# EAGLE design DMGC-CPU-01_2-2 (EAGLE 9.6.2)
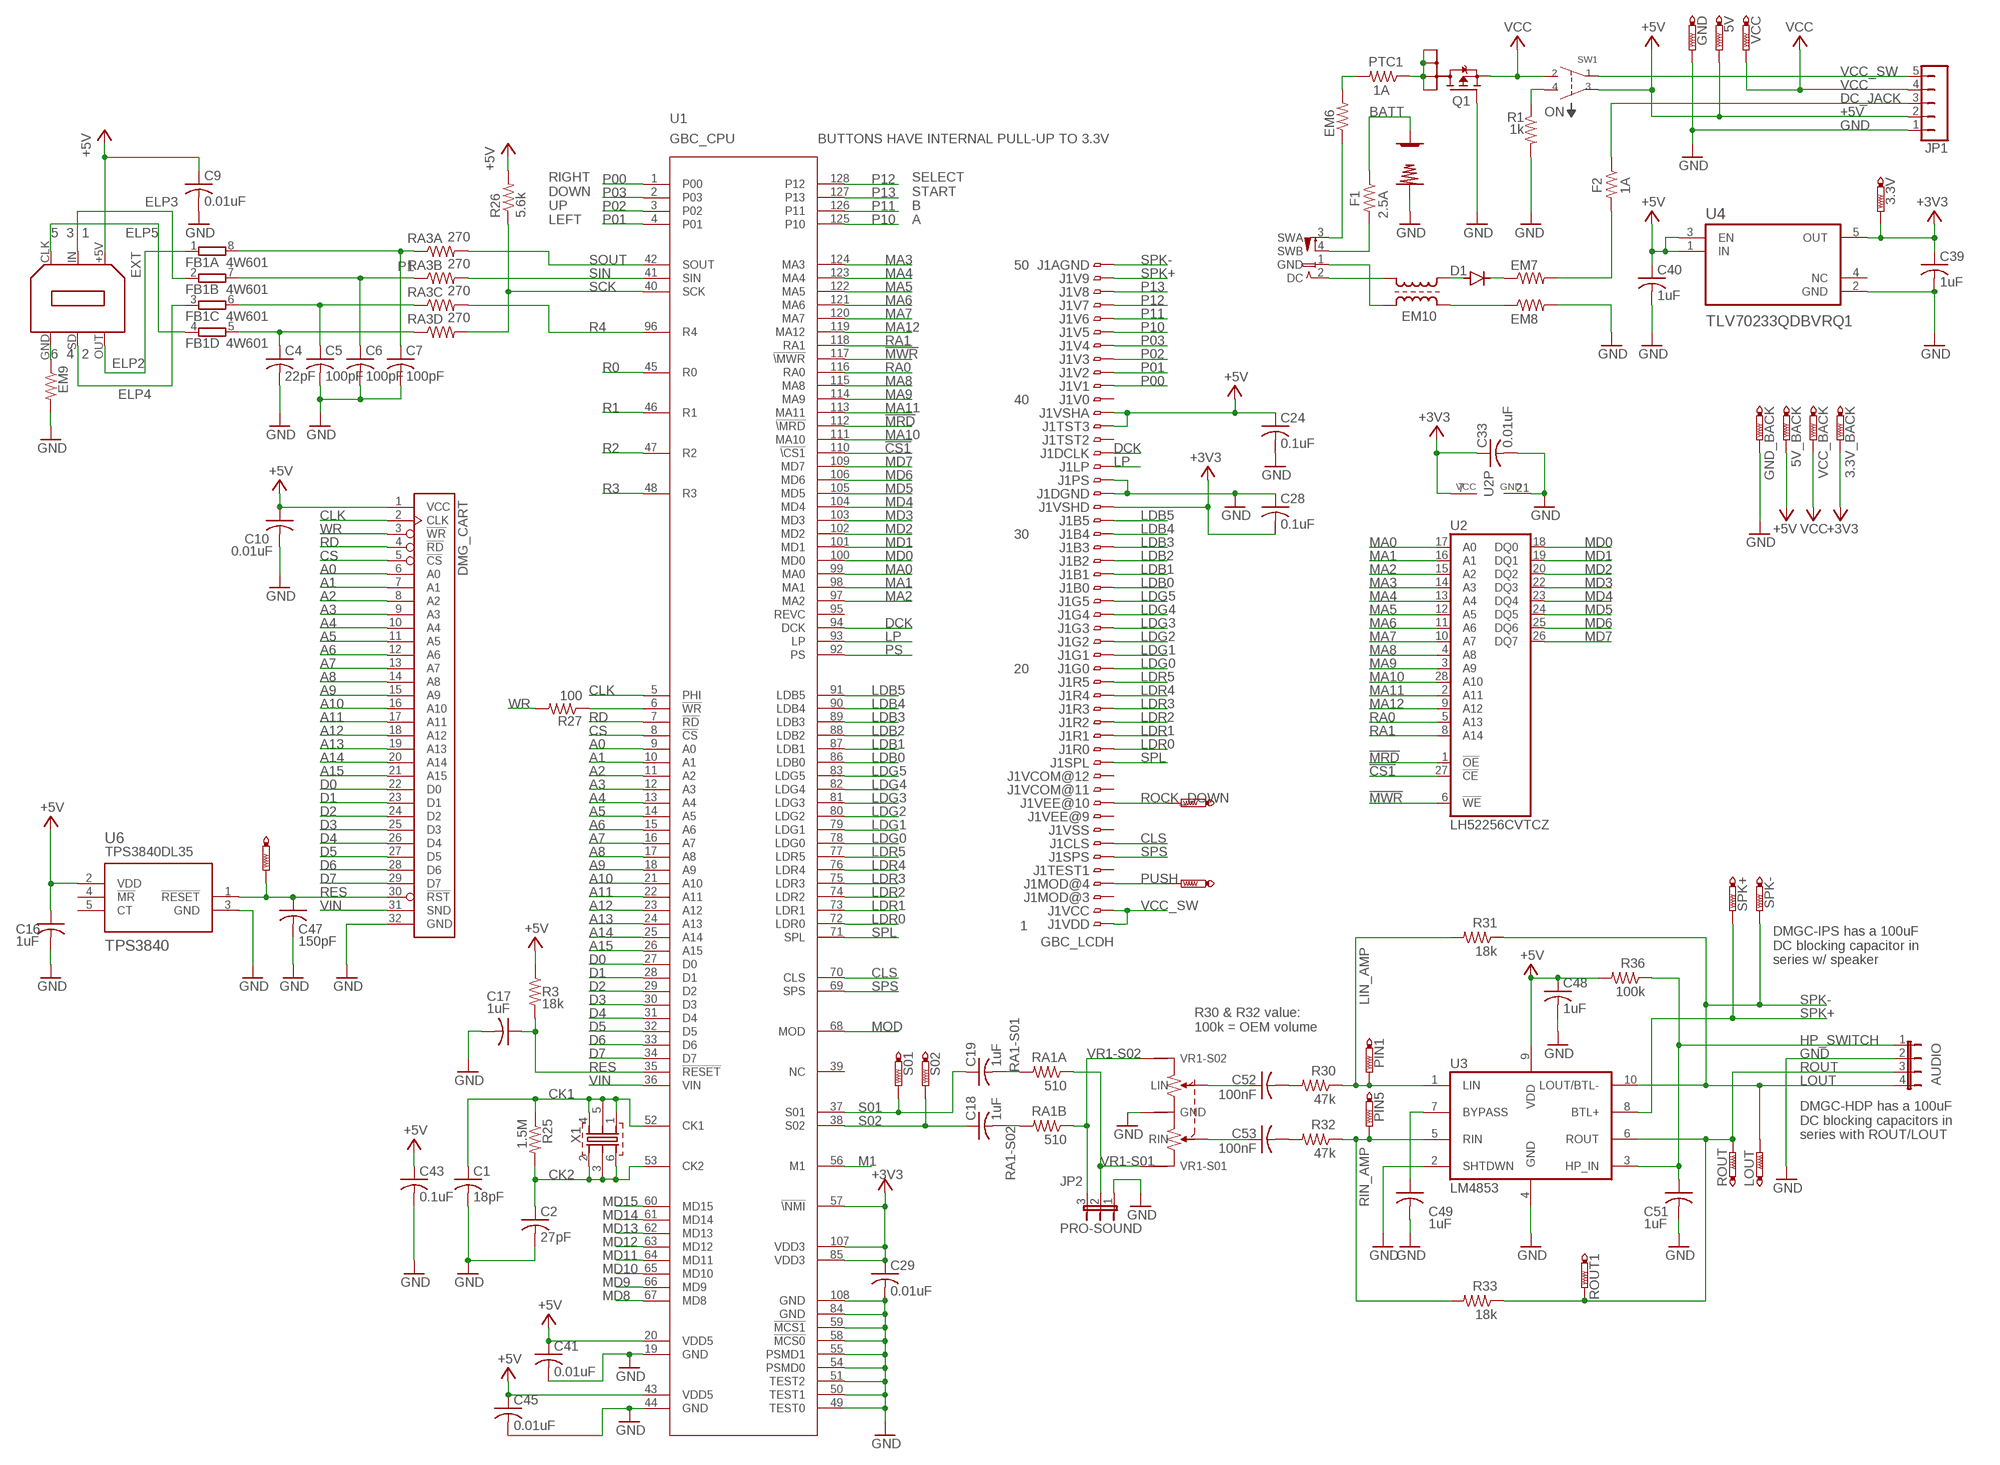
[diagram p0: schematic, sheet 1]

## Parts
3.3V  PTR1B1,27  [B1,27]
3.3V_BACK  PTR1B1,27  [B1,27]
5V  PTR1B1,27  [B1,27]
5V_BACK  PTR1B1,27  [B1,27]
+  DMG_BAT_POS  [DMG_BAT_POS]
-  DMG_BAT_NEG  [DMG_BAT_NEG]
AUDIO  JP4E  [JP4]
C1  18pF  C-USC0603  [C0603]
C2  27pF  C-USC0603  [C0603]
C4  22pF  C-USC0603  [C0603]
C5  100pF  C-USC0603  [C0603]
C6  100pF  C-USC0603  [C0603]
C7  100pF  C-USC0603  [C0603]
C9  0.01uF  C-USC0603  [C0603]
C10  0.01uF  C-USC0603  [C0603]
C16  1uF  C-USC0603  [C0603]
C17  1uF  C-USC0603  [C0603]
C18  1uF  C-USC0603  [C0603]
C19  1uF  C-USC0603  [C0603]
C24  0.1uF  C-USC0603  [C0603]
C28  0.1uF  C-USC0603  [C0603]
C29  0.01uF  C-USC0603  [C0603]
C33  0.01uF  C-USC0603  [C0603]
C39  1uF  C-USC0603  [C0603]
C40  1uF  C-USC0603  [C0603]
C41  0.01uF  C-USC0603  [C0603]
C43  0.1uF  C-USC0603  [C0603]
C45  0.01uF  C-USC0603  [C0603]
C47  150pF  C-USC0603  [C0603]
C48  1uF  C-USC0603  [C0603]
C49  1uF  C-USC0603  [C0603]
C51  1uF  C-USC0603  [C0603]
C52  100nF  C-USC0603  [C0603]
C53  100nF  C-USC0603  [C0603]
D1  CGRM4001-G  [SOD-123_MINI-SMA]
DCJACK  DMG_DCJACK  [DMG_DCJACK]
EM6  BLM21P221SG  R-US_R0805  [R0805]
EM7  BLM21P221SG  R-US_R0805  [R0805]
EM8  BLM21P221SG  R-US_R0805  [R0805]
EM9  BLM21P221SG  R-US_R0603  [R0603]
EM10  ACM4532-801-2PA  [ACM4532]
EXT  LINKPORTDMG-LINK-SHORT  DMG_EXTDMG-LINK  [DMG_EXT]
F1  2.5A  R-US_R1206  [R1206]
F2  1A  R-US_R1206  [R1206]
FB1  4W601  4R-NEXB38V  [EXB38V]
GND  PTR1B1,27  [B1,27]
GND_BACK  PTR1B1,27  [B1,27]
J1  GBC_LCDH  [FH12-50S-0.5SH]
JP1  JP5  [JP5]
JP2  JP2E  [JP2]
LOUT  PTR1B1,27  [B1,27]
P1  DMG_CART  [DMG_CART]
PIN1  PTR1B1,27  [B1,27]
PIN5  PTR1B1,27  [B1,27]
PTC1  1A  R-US_R1206  [R1206]
PUSH  PTR1B1,27  [B1,27]
Q1  SI1401EDH  [SOT363_INFINEON]
R1  1k  R-US_R0603  [R0603]
R3  18k  R-US_R0603  [R0603]
R25  1.5M  R-US_R0603  [R0603]
R26  5.6k  R-US_R0603  [R0603]
R27  100  R-US_R0603  [R0603]
R30  47k  R-US_R0603  [R0603]
R31  18k  R-US_R0603  [R0603]
R32  47k  R-US_R0603  [R0603]
R33  18k  R-US_R0603  [R0603]
R36  100k  R-US_R0603  [R0603]
RA1A  510  R-US_R0603  [R0603]
RA1B  510  R-US_R0603  [R0603]
RA3A  270  R-US_R0603  [R0603]
RA3B  270  R-US_R0603  [R0603]
RA3C  270  R-US_R0603  [R0603]
RA3D  270  R-US_R0603  [R0603]
ROCKDOWN  PTR1B1,27  [B1,27]
ROUT  PTR1B1,27  [B1,27]
ROUT1  PTR1B1,27  [B1,27]
RST  PTR1B1,27  [B1,27]
S01  PTR1B1,27  [B1,27]
S02  PTR1B1,27  [B1,27]
SPK+  PTR1B1,27  [B1,27]
SPK-  PTR1B1,27  [B1,27]
SW1  DMG_SW  [DMG_SW]
U1  GBC_CPU  [QFP-128]
U2  LH52256CVTCZ  [TSOP1-28]
U3  LM4853  [VSSOP10]
U4  TLV70233QDBVRQ1  [SOT95P280X145-5N]
U6  TPS3840  [SOT-23-5]
U$1  DMG_VOL  [DMG_VOL]
VCC  PTR1B1,27  [B1,27]
VCC_BACK  PTR1B1,27  [B1,27]
X1  8.388608MHZ12SMX-B-4-PAD  [7.5X5-4-PAD]

## Nets
!CS1: U1.110(!\CS1) U2.27(!CE)
!MRD: U1.112(!\MRD) U2.1(!OE)
!MWR: U1.117(!\MWR) U2.6(!WE)
+3V3: 3.3V.TP 3.3V_BACK.TP C28.2 C29.1 C33.1 C39.1 J1.32 U1.57(!\NMI) U1.85(VDD3) U1.107(VDD3) U2.7(VCC) U4.5(OUT)
+5V: 5V.TP 5V_BACK.TP C9.1 C10.1 C16.1 C24.1 C40.1 C41.1 C43.1 C45.1 C48.1 EXT.+5V J1.38 J1.39 JP1.2 P1.1(VCC) R3.1 R26.2 R36.2 SW1.P$3 U1.20(VDD5) U1.43(VDD5) U3.9(VDD) U4.1(IN) U4.3(EN) U6.2(VDD)
A0: P1.6(A0) U1.9(A0)
A1: P1.7(A1) U1.10(A1)
A2: P1.8(A2) U1.11(A2)
A3: P1.9(A3) U1.12(A3)
A4: P1.10(A4) U1.13(A4)
A5: P1.11(A5) U1.14(A5)
A6: P1.12(A6) U1.15(A6)
A7: P1.13(A7) U1.16(A7)
A8: P1.14(A8) U1.17(A8)
A9: P1.15(A9) U1.18(A9)
A10: P1.16(A10) U1.21(A10)
A11: P1.17(A11) U1.22(A11)
A12: P1.18(A12) U1.23(A12)
A13: P1.19(A13) U1.24(A13)
A14: P1.20(A14) U1.25(A14)
A15: P1.21(A15) U1.26(A15)
BATT: +.P$1 F1.1
BATT_DC: DCJACK.3(SWA) EM6.1
CK1: C1.1 R25.1 U1.52(CK1) X1.1 X1.4 X1.5
CK2: C2.1 R25.2 U1.53(CK2) X1.2 X1.3 X1.6
CLK: P1.2(CLK) U1.5(PHI)
CLS: J1.7 U1.70(CLS)
CS: P1.5(!CS) U1.8(!CS)
D0: P1.22(D0) U1.27(D0)
D1: P1.23(D1) U1.28(D1)
D2: P1.24(D2) U1.29(D2)
D3: P1.25(D3) U1.30(D3)
D4: P1.26(D4) U1.31(D4)
D5: P1.27(D5) U1.32(D5)
D6: P1.28(D6) U1.33(D6)
D7: P1.29(D7) U1.34(D7)
DC_JACK: F2.1 JP1.3
DCK: J1.36 U1.94(DCK)
ELP2: EXT.OUT FB1.1
ELP3: EXT.IN FB1.2
ELP4: EXT.SD FB1.3
ELP5: EXT.CLK FB1.4
EM10_EM8: EM8.1 EM10.3
EM10_GND: DCJACK.1(GND) EM10.2
EM10_POS: DCJACK.2(DC) EM10.1
GND: -.P$1 AUDIO.2 C1.2 C2.2 C4.2 C5.2 C6.2 C7.2 C9.2 C10.2 C16.2 C17.2 C24.2 C28.1 C29.2 C33.2 C39.2 C40.2 C41.2 C43.2 C45.2 C47.2 C48.2 C49.2 C51.2 EM8.2 EM9.2 GND.TP GND_BACK.TP J1.33 J1.34 JP1.1 JP2.1 P1.32(GND) Q1.3(G) R1.2 U1.19(GND) U1.44(GND) U1.49(TEST0) U1.50(TEST1) U1.51(TEST2) U1.54(PSMD0) U1.55(PSMD1) U1.58(!MCS0) U1.59(!MCS1) U1.84(GND) U1.108(GND) U2.21(GND) U3.2(SHTDWN) U3.4(GND) U4.2(GND) U6.3(GND) U$1.P$1(GND)
HP_SWITCH: AUDIO.1 C51.1 R36.1 U3.3(HP_IN)
LDB0: J1.26 U1.86(LDB0)
LDB1: J1.27 U1.87(LDB1)
LDB2: J1.28 U1.88(LDB2)
LDB3: J1.29 U1.89(LDB3)
LDB4: J1.30 U1.90(LDB4)
LDB5: J1.31 U1.91(LDB5)
LDG0: J1.20 U1.78(LDG0)
LDG1: J1.21 U1.79(LDG1)
LDG2: J1.22 U1.80(LDG2)
LDG3: J1.23 U1.81(LDG3)
LDG4: J1.24 U1.82(LDG4)
LDG5: J1.25 U1.83(LDG5)
LDR0: J1.14 U1.72(LDR0)
LDR1: J1.15 U1.73(LDR1)
LDR2: J1.16 U1.74(LDR2)
LDR3: J1.17 U1.75(LDR3)
LDR4: J1.18 U1.76(LDR4)
LDR5: J1.19 U1.77(LDR5)
LIN_AMP: PIN1.TP R30.1 R31.2 U3.1(LIN)
LP: J1.35 U1.93(LP)
M1: U1.56(M1)
MA0: U1.99(MA0) U2.17(A0)
MA1: U1.98(MA1) U2.16(A1)
MA2: U1.97(MA2) U2.15(A2)
MA3: U1.124(MA3) U2.14(A3)
MA4: U1.123(MA4) U2.13(A4)
MA5: U1.122(MA5) U2.12(A5)
MA6: U1.121(MA6) U2.11(A6)
MA7: U1.120(MA7) U2.10(A7)
MA8: U1.115(MA8) U2.4(A8)
MA9: U1.114(MA9) U2.3(A9)
MA10: U1.111(MA10) U2.28(A10)
MA11: U1.113(MA11) U2.2(A11)
MA12: U1.119(MA12) U2.9(A12)
MD0: U1.100(MD0) U2.18(DQ0)
MD1: U1.101(MD1) U2.19(DQ1)
MD2: U1.102(MD2) U2.20(DQ2)
MD3: U1.103(MD3) U2.22(DQ3)
MD4: U1.104(MD4) U2.23(DQ4)
MD5: U1.105(MD5) U2.24(DQ5)
MD6: U1.106(MD6) U2.25(DQ6)
MD7: U1.109(MD7) U2.26(DQ7)
MD8: U1.67(MD8)
MD9: U1.66(MD9)
MD10: U1.65(MD10)
MD11: U1.64(MD11)
MD12: U1.63(MD12)
MD13: U1.62(MD13)
MD14: U1.61(MD14)
MD15: U1.60(MD15)
MOD: U1.68(MOD)
N$1: C7.1 FB1.8 RA3A.1
N$2: C6.1 FB1.7 RA3B.1
N$4: C52.2 R30.2
N$5: C53.2 R32.2
N$6: C5.1 FB1.6 RA3C.1
N$7: C52.1 U$1.P$3(LIN)
N$8: R27.1 U1.6(!WR)
N$9: C4.1 FB1.5 RA3D.1
N$10: C53.1 U$1.P$2(RIN)
N$11: R1.1 SW1.P$4
N$13: D1.C EM7.1
N$15: EM7.2 F2.2
N$16: EM6.2 PTC1.2
N$24: EM9.1 EXT.GND
N$29: C49.1 U3.7(BYPASS)
P00: J1.41 U1.1(P00)
P01: J1.42 U1.4(P01)
P02: J1.43 U1.3(P02)
P03: J1.44 U1.2(P03)
P10: J1.45 U1.125(P10)
P11: J1.46 U1.126(P11)
P12: J1.47 U1.128(P12)
P13: J1.48 U1.127(P13)
PFET_DRAIN: PTC1.1 Q1.1(D1) Q1.2(D2) Q1.5(D5) Q1.6(D6)
PS: U1.92(PS)
PUSH: J1.4 PUSH.TP
R0: U1.45(R0)
R1: U1.46(R1)
R2: U1.47(R2)
R3: U1.48(R3)
R4: RA3C.2 U1.96(R4)
RA0: U1.116(RA0) U2.5(A13)
RA1: U1.118(RA1) U2.8(A14)
RA1-S01: C19.2 RA1A.2
RA1-S02: C18.2 RA1B.2
RD: P1.4(!RD) U1.7(!RD)
RES: C17.1 C47.1 P1.30(!RST) R3.2 RST.TP U1.35(!RESET) U6.1(!RESET)
RIN_AMP: PIN5.TP R32.1 R33.2 U3.5(RIN)
ROCK_DOWN: J1.10 ROCKDOWN.TP
ROUT: AUDIO.3 R33.1 ROUT1.TP ROUT.TP U3.6(ROUT)
RPP: D1.A EM10.4
S01: C19.1 S01.TP U1.37(S01)
S02: C18.1 S02.TP U1.38(S02)
SCK: R26.1 RA3D.2 U1.40(SCK)
SIN: RA3B.2 U1.41(SIN)
SOUT: RA3A.2 U1.42(SOUT)
SPK+: J1.49 SPK+.TP U3.8(BTL+)
SPK-: AUDIO.4 J1.50 LOUT.TP R31.1 SPK-.TP U3.10(LOUT/BTL-)
SPL: J1.13 U1.71(SPL)
SPS: J1.6 U1.69(SPS)
SW1B: DCJACK.4(SWB) F1.2
VCC: JP1.4 Q1.4(S) SW1.P$2 VCC.TP VCC_BACK.TP
VCC_SW: J1.1 J1.2 JP1.5 SW1.P$1
VIN: P1.31(SND) U1.36(VIN)
VR1-S01: JP2.2 RA1A.1 U$1.P$5(VR1-S01)
VR1-S02: JP2.3 RA1B.1 U$1.P$4(VR1-S02)
WR: P1.3(!WR) R27.2
Unconnected: J1.3 J1.5 J1.8 J1.9 J1.11 J1.12 J1.37 J1.40 U1.39(NC) U1.95(REVC) U4.4(NC) U6.4(!MR) U6.5(CT)

## Notes on the sheet
- BUTTONS HAVE INTERNAL PULL-UP TO 3.3V
- RIGHT
  DOWN
  UP
  LEFT
- SELECT
  START
  B
  A
- 5  3  1
- 50
- 6  4  2
- 40
- 30
- 20
- TPS3840DL35
- 1
- DMGC-IPS has a 100uF 
  DC blocking capacitor in
  series w/ speaker
- R30 & R32 value:
  100k = OEM volume
- LOUT
- DMGC-HDP has a 100uF 
  DC blocking capacitors in
  series with ROUT/LOUT
- PRO-SOUND

## Power pins joined to a net without a drawn wire
GND: EXT.SHIELD1(GND) EXT.SHIELD(GND) SW1.P$7(GND) SW1.P$8(GND) U$1.P$6(GND) U$1.P$7(GND)

## Library data of the parts
3.3V 3.3V_BACK 5V 5V_BACK GND GND_BACK LOUT PIN1 PIN5 PUSH ROCKDOWN ROUT ROUT1 RST S01 S02 SPK+ SPK- VCC VCC_BACK = testpad:PTR1: TEST PIN
+ = gameboy:DMG_BAT_POS
- = gameboy:DMG_BAT_NEG
AUDIO = jumper:JP4E: JUMPER
C1 C2 C4-C7 C9 C10 C16-C19 C24 C28 C29 C33 C39-C41 C43 C45 C47-C49 C51-C53 = rcl:C-US: CAPACITOR, American symbol; SPICEPREFIX: C
D1 = diode:CGRM400*-G: Molded plasitc,JEDEC SOD-123/Mini SMA Source: Comchip CGRM4001-G.pdf
DCJACK = gameboy:DMG_DCJACK
EM6-EM9 F1 F2 PTC1 R1 R3 R25-R27 R30-R33 R36 RA1A RA1B RA3A RA3B RA3C RA3D = rcl:R-US_: RESISTOR, American symbol; SPICEPREFIX: R
EM10 = gameboy:ACM4532-801-2P: TRANSFORMER SMD transformer; OC_FARNELL: unknown; OC_NEWARK: unknown
EXT = gameboy:DMG_EXT
FB1 = resistor-dil:4R-N: Array Chip Resistor Source: RS Component / Phycomp; OC_FARNELL: unknown; OC_NEWARK: unknown
J1 = gameboy:GBC_LCD: 0.5mm Pitch Connectors For FPC/FFC Source: Data sheet <http://www.hirose.co.jp/cataloge_hp/e58605370.pdf>; MPN: FH12-50S-0.5SH(55); OC_FARNELL: 1324557; OC_NEWARK: 34M6181
JP1 = jumper:JP5: JUMPER
JP2 = jumper:JP2E: JUMPER
P1 = gameboy:DMG_CART
Q1 = transistor-fet:SI1401EDH: OptiMOS(R)-P Small-Signal-Transistor Dual P-Channel, Enhancement mode, Super Logic Level (2.5 V rated) Source: http://www.infineon.com/upload/Document/BSD223P_Rev1.3.pdf
SW1 = gameboy:DMG_SW: DMG Power Switch
U1 = gameboy:GBC_CPU: lfxp3e_tqfp144 edit this description Auto generated by make-symbol-device-package-bsdl.ulp Rev. 20 Source: lfxp3e_tqfp144.bsm
U2 = gameboy:LH52256CVT: 256K (32K x 8) CMOS-Static RAM Source: http://download.cypress.com.edgesuite.net/design_resources/datasheets/contents/cy62256_8.pdf
U3 = gameboy:LM4853: LM4853
U4 = TLV70233QDBVRQ1:TLV70233QDBVRQ1: Check availability <https://pricing.snapeda.com/parts/TLV70233QDBVRQ1/Texas%20Instruments/view-part?ref=eda>; AVAILABILITY: In Stock; DESCRIPTION: Automotive 300-mA, high-PSRR, low-IQ, low-dropout voltage regulator with enable 5-SOT-23 -40 to 125; MF: Texas Instruments; MP: TLV70233QDBVRQ1; PACKAGE: SOT-23-5 Texas Instruments; PRICE: None; PURCHASE-URL: https://pricing.snapeda.com/search/part/TLV70233QDBVRQ1/?ref=eda
U6 = SOT95P280X145-5N:TPS3840
U$1 = gameboy:DMG_VOL
X1 = gameboy:8.388608MHZ: CRYSTALS WITH CAN GROUNDED

## Net classes
1 VCC: width 0.203 mm

## Board
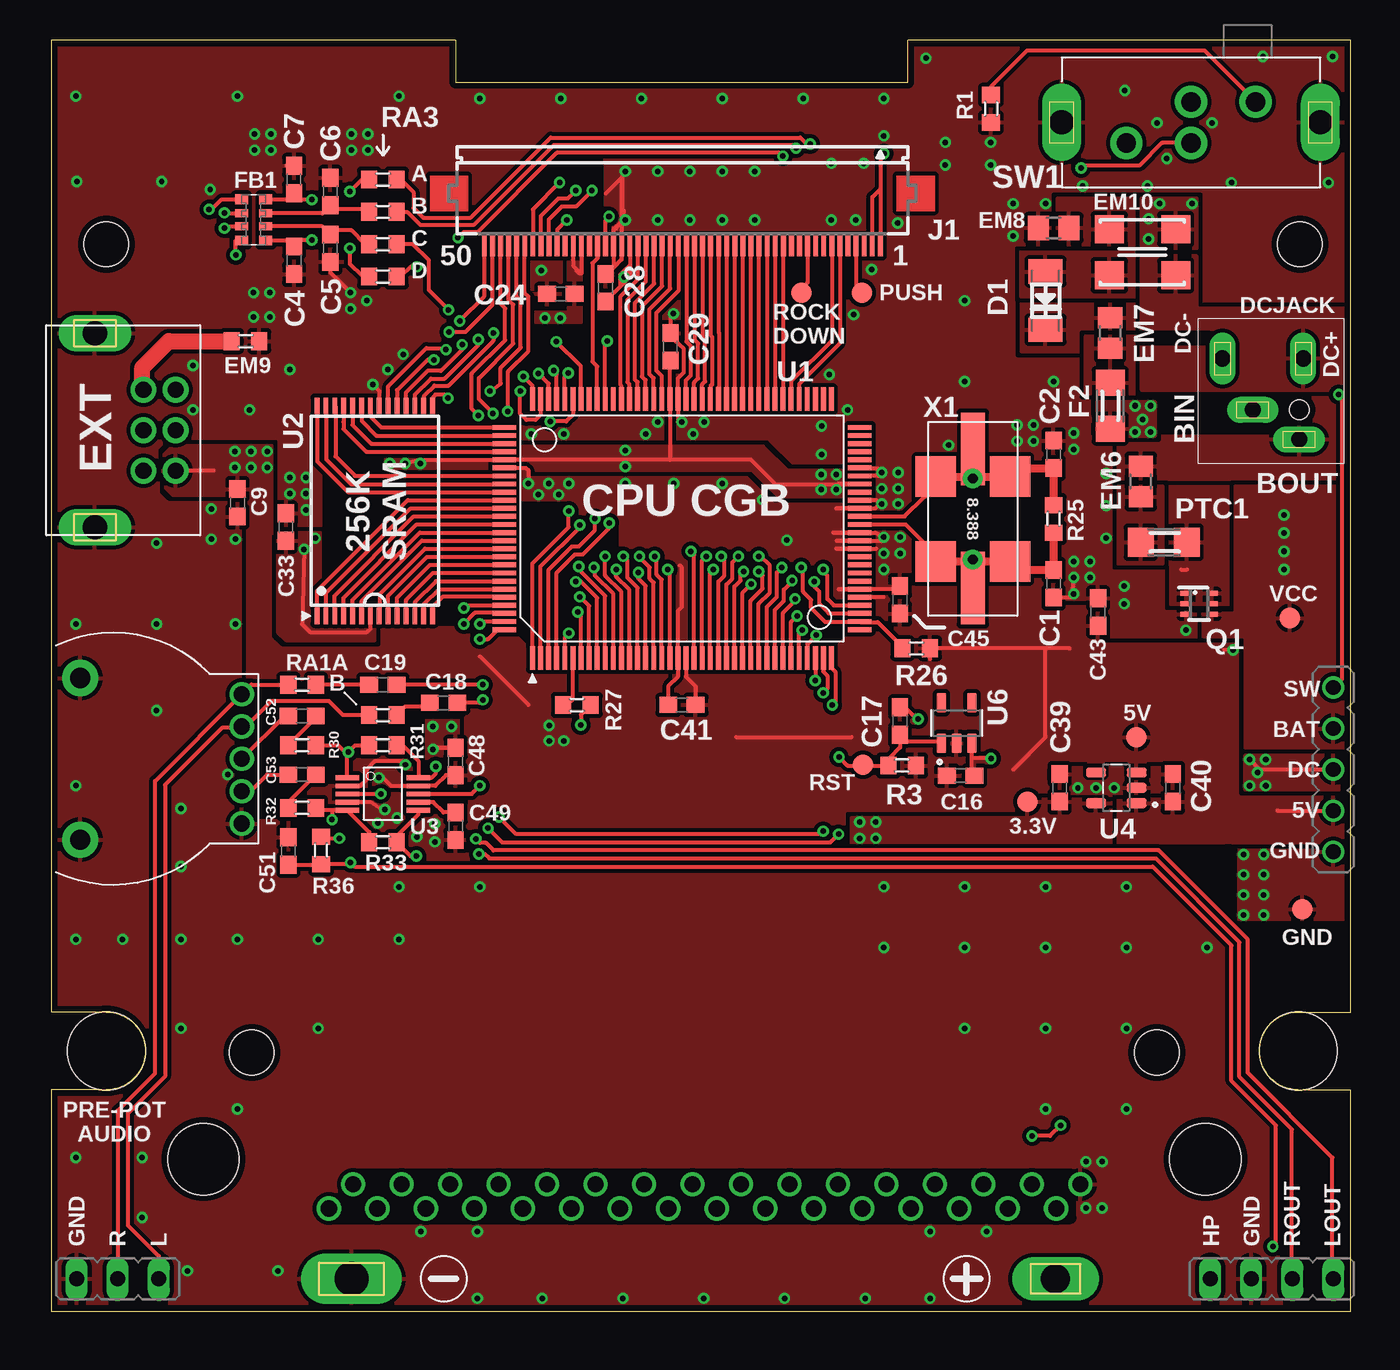
[diagram p1: board, top side]
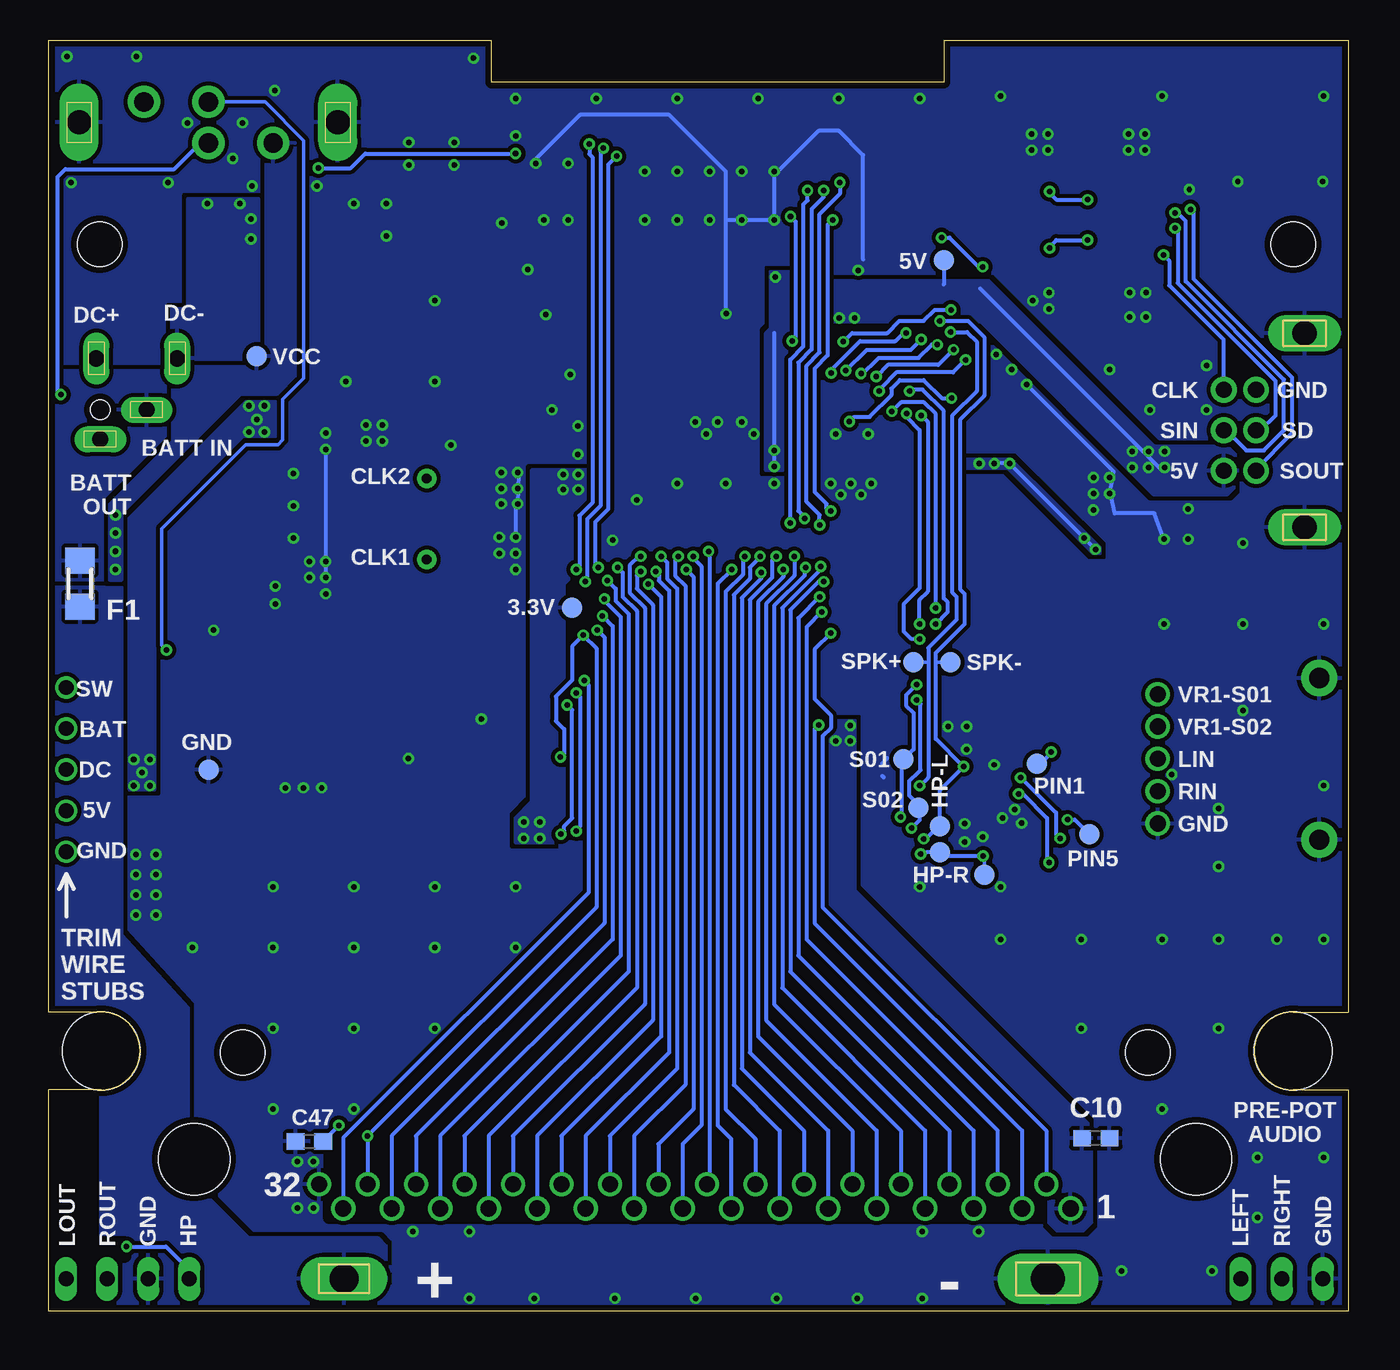
[diagram p2: board, bottom side, seen from below]

Size 80.4 x 78.6 mm. Coordinates in mm from the lower left corner, seen from the top.
Outline: 0,0 80.4,0 80.4,13.7 77.15,13.7 arc-180 77.15,18.5 80.4,18.5 80.4,78.6 53.01,78.6 53.01,76 25.01,76 25.01,78.6 0,78.6 0,18.5 3.4,18.5 arc-180 3.4,13.7 2.9,13.7 0,13.7 0,0
Copper layers (1*16): Top 0.0356mm / dielectric 1.5011mm / Bottom 0.0356mm
Design rules "jlcpcb *": minimum track width 8mil, minimum drill 13mil, track to track 7mil, track to pad 7mil, pad to pad 7mil, via to via 7mil, smd to smd 5mil, copper to edge 15mil, drill to drill 22mil, minimum pad ring 7mil, minimum via ring 7mil, stop-mask expansion 2.5mil, vias tented up to drill 14mil, thermal gap 10mil
Holes 2.75 mm at 3.4,66 77.25,66 12.4,16 68.4,16
Holes 4.4 mm at 9.4,9.4 71.4,9.4
Holes 4.8 mm at 3.4,16.1 77.14,16.1
tKeepout: area -2,5 to 83,27
tRestrict: area 17.2,47.5 to 17.5,52; area 21.5,35.5 to 21.7,36.5; area 28.5,49 to 32,49.7; area 34.5,47 to 34.7,48.7; area 17.1,5.8 to 63.1,8.4; area 22.5,34 to 25.3,37.5; area 12.9,30.8 to 13.8,32.4; area 33.8,66 to 35.3,66.4; area 34.3,64.6 to 35.1,64.8; area 32.1,66.8 to 33.8,71; area 49.9,47 to 50.1,52.1; area 72.6,23.5 to 81.4,28.5; 5 more areas
bRestrict: area 18.7,5.8 to 63.1,8.4; area 62.5,8.5 to 63,9.9; area 75.6,3.4 to 78.8,15.4

### Footprints (pad centres in the part's own frame; a part is rotated, then mirrored left to right if it is on the bottom)
B1,27 = smd 1.27 x 1.27: TP 0,0
DMG_BAT_POS = drill 1.8 long: P$1 0,0
DMG_BAT_NEG = drill 2.1 long: P$1 0,-0.008
JP4 = drill 0.914 long: 1 -3.81,0; 2 -1.27,0; 3 1.27,0; 4 3.81,0
C0603 = smd 1.1 x 1: 1 -0.85,0; 2 0.85,0
SOD-123_MINI-SMA = smd 1.5 x 2.1: A 1.8,0; C -1.8,0
DMG_DCJACK = drill 1 pad 1.6 long: 1 -2.5,0; 2 2.5,0; 3 2.25,-5; 4 -0.625,-3.175 | hole 1.2: 2.25,-3.175
R0805 = smd 1.3 x 1.5: 1 -0.95,0; 2 0.95,0
R0603 = smd 1 x 1.1: 1 -0.85,0; 2 0.85,0
ACM4532 = smd 1.8 x 1.75: 1 -2.05,1.425; 2 -2.05,-1.425; 3 2.05,-1.425; 4 2.05,1.425
DMG_EXT = drill 1 pad 1.6: +5V 2.5,5; CLK -2.5,5; GND -2.5,3; IN 0,5; OUT 2.5,3; SD 0,3 | drill 1.5 long: SHIELD -6,0; SHIELD1 6,0
R1206 = smd 1.6 x 1.803: 1 -1.422,0; 2 1.422,0
EXB38V = smd 0.6 x 0.8: 1 -1.275,-0.75; 4 1.275,-0.75; 5 1.275,0.75; 8 -1.275,0.75 | smd 0.5 x 0.8: 2 -0.4,-0.75; 3 0.4,-0.75; 6 0.4,0.75; 7 -0.4,0.75
FH12-50S-0.5SH = smd 0.3 x 1.3: 1 -12.25,3.25; 2 -11.75,3.25; 3 -11.25,3.25; 4 -10.75,3.25; 5 -10.25,3.25; 6 -9.75,3.25; 7 -9.25,3.25; 8 -8.75,3.25; 9 -8.25,3.25; 10 -7.75,3.25; 11 -7.25,3.25; 12 -6.75,3.25; 13 -6.25,3.25; 14 -5.75,3.25; 15 -5.25,3.25; 16 -4.75,3.25; 17 -4.25,3.25; 18 -3.75,3.25; 19 -3.25,3.25; 20 -2.75,3.25; 21 -2.25,3.25; 22 -1.75,3.25; 23 -1.25,3.25; 24 -0.75,3.25; 25 -0.25,3.25; 26 0.25,3.25; 27 0.75,3.25; 28 1.25,3.25; 29 1.75,3.25; 30 2.25,3.25; 31 2.75,3.25; 32 3.25,3.25; 33 3.75,3.25; 34 4.25,3.25; 35 4.75,3.25; 36 5.25,3.25; 37 5.75,3.25; 38 6.25,3.25; 39 6.75,3.25; 40 7.25,3.25; 41 7.75,3.25; 42 8.25,3.25; 43 8.75,3.25; 44 9.25,3.25; 45 9.75,3.25; 46 10.25,3.25; 47 10.75,3.25; 48 11.25,3.25; 49 11.75,3.25; 50 12.25,3.25
JP5 = drill 0.914: 1 -5.08,0; 2 -2.54,0; 3 0,0; 4 2.54,0; 5 5.08,0
JP2 = drill 0.914 long: 1 -2.54,0; 2 0,0; 3 2.54,0
DMG_CART = drill 1: 1 0,0; 2 -1.5,1.5; 3 0,3; 4 -1.5,4.5; 5 0,6; 6 -1.5,7.5; 7 0,9; 8 -1.5,10.5; 9 0,12; 10 -1.5,13.5; 11 0,15; 12 -1.5,16.5; 13 0,18; 14 -1.5,19.5; 15 0,21; 16 -1.5,22.5; 17 0,24; 18 -1.5,25.5; 19 0,27; 20 -1.5,28.5; 21 0,30; 22 -1.5,31.5; 23 0,33; 24 -1.5,34.5; 25 0,36; 26 -1.5,37.5; 27 0,39; 28 -1.5,40.5; 29 0,42; 30 -1.5,43.5; 31 0,45; 32 -1.5,46.5
SOT363_INFINEON = smd 0.3 x 0.7: 1 -0.65,-0.8; 2 0,-0.8; 3 0.65,-0.8; 4 0.65,0.8; 5 0,0.8; 6 -0.65,0.8
DMG_SW = drill 1.2 pad 2: P$1 0,-1.27; P$2 -4,-1.27; P$3 0,1.27; P$4 4,1.27 | drill 1.5 pad 2.4 long: P$7 -8,0; P$8 8,0
QFP-128 = smd 0.3 x 1.45: 1 -8.25,-4.5; 2 -7.75,-4.5; 3 -7.25,-4.5; 4 -6.75,-4.5; 5 -6.25,-4.5; 6 -5.75,-4.5; 7 -5.25,-4.5; 8 -4.75,-4.5; 9 -4.25,-4.5; 10 -3.75,-4.5; 11 -3.25,-4.5; 12 -2.75,-4.5; 13 -2.25,-4.5; 14 -1.75,-4.5; 15 -1.25,-4.5; 16 -0.75,-4.5; 17 -0.25,-4.5; 18 0.25,-4.5; 19 0.75,-4.5; 20 1.25,-4.5; 21 1.75,-4.5; 22 2.25,-4.5; 23 2.75,-4.5; 24 3.25,-4.5; 25 3.75,-4.5; 26 4.25,-4.5; 27 4.75,-4.5; 28 5.25,-4.5; 29 5.75,-4.5; 30 6.25,-4.5; 31 6.75,-4.5; 32 7.25,-4.5; 33 7.75,-4.5; 34 8.25,-4.5; 35 8.75,-4.5; 36 9.25,-4.5; 37 9.75,-4.5; 38 10.25,-4.5; 65 10.25,11.5; 66 9.75,11.5; 67 9.25,11.5; 68 8.75,11.5; 69 8.25,11.5; 70 7.75,11.5; 71 7.25,11.5; 72 6.75,11.5; 73 6.25,11.5; 74 5.75,11.5; 75 5.25,11.5; 76 4.75,11.5; 77 4.25,11.5; 78 3.75,11.5; 79 3.25,11.5; 80 2.75,11.5; 81 2.25,11.5; 82 1.75,11.5; 83 1.25,11.5; 84 0.75,11.5; 85 0.25,11.5; 86 -0.25,11.5; 87 -0.75,11.5; 88 -1.25,11.5; 89 -1.75,11.5; 90 -2.25,11.5; 91 -2.75,11.5; 92 -3.25,11.5; 93 -3.75,11.5; 94 -4.25,11.5; 95 -4.75,11.5; 96 -5.25,11.5; 97 -5.75,11.5; 98 -6.25,11.5; 99 -6.75,11.5; 100 -7.25,11.5; 101 -7.75,11.5; 102 -8.25,11.5 | smd 1.45 x 0.3: 39 12,-2.75; 40 12,-2.25; 41 12,-1.75; 42 12,-1.25; 43 12,-0.75; 44 12,-0.25; 45 12,0.25; 46 12,0.75; 47 12,1.25; 48 12,1.75; 49 12,2.25; 50 12,2.75; 51 12,3.25; 52 12,3.75; 53 12,4.25; 54 12,4.75; 55 12,5.25; 56 12,5.75; 57 12,6.25; 58 12,6.75; 59 12,7.25; 60 12,7.75; 61 12,8.25; 62 12,8.75; 63 12,9.25; 64 12,9.75; 103 -10,9.75; 104 -10,9.25; 105 -10,8.75; 106 -10,8.25; 107 -10,7.75; 108 -10,7.25; 109 -10,6.75; 110 -10,6.25; 111 -10,5.75; 112 -10,5.25; 113 -10,4.75; 114 -10,4.25; 115 -10,3.75; 116 -10,3.25; 117 -10,2.75; 118 -10,2.25; 119 -10,1.75; 120 -10,1.25; 121 -10,0.75; 122 -10,0.25; 123 -10,-0.25; 124 -10,-0.75; 125 -10,-1.25; 126 -10,-1.75; 127 -10,-2.25; 128 -10,-2.75
TSOP1-28 = smd 1 x 0.3: 1 -6.5,3.575; 2 -6.5,3.025; 3 -6.5,2.475; 4 -6.5,1.925; 5 -6.5,1.375; 6 -6.5,0.825; 7 -6.5,0.275; 8 -6.5,-0.275; 9 -6.5,-0.825; 10 -6.5,-1.375; 11 -6.5,-1.925; 12 -6.5,-2.475; 13 -6.5,-3.025; 14 -6.5,-3.575; 15 6.5,-3.575; 16 6.5,-3.025; 17 6.5,-2.475; 18 6.5,-1.925; 19 6.5,-1.375; 20 6.5,-0.825; 21 6.5,-0.275; 22 6.5,0.275; 23 6.5,0.825; 24 6.5,1.375; 25 6.5,1.925; 26 6.5,2.475; 27 6.5,3.025; 28 6.5,3.575
VSSOP10 = smd 1.45 x 0.3: 1 -2.2,0.985; 2 -2.2,0.485; 3 -2.2,-0.015; 4 -2.2,-0.515; 5 -2.2,-1.015; 6 2.2,-1.015; 7 2.2,-0.515; 8 2.2,-0.015; 9 2.2,0.485; 10 2.2,0.985
SOT95P280X145-5N = smd 1.21 x 0.59: 1 -1.255,0.95; 2 -1.255,0; 3 -1.255,-0.95; 4 1.255,-0.95; 5 1.255,0.95
SOT-23-5 = smd 1.21 x 0.59: 1 -1.255,0.95; 2 -1.255,0; 3 -1.255,-0.95; 4 1.255,-0.95; 5 1.255,0.95
DMG_VOL = drill 1 pad 1.5: P$1 -4,-5; P$2 -2,-5; P$3 0,-5; P$4 2,-5; P$5 4,-5 | drill 1.25 pad 2.25: P$6 -5,5; P$7 5,5
7.5X5-4-PAD = smd 2.5 x 2.5: 1 2.3,-2.625; 2 2.3,2.625; 3 -2.3,2.625; 4 -2.3,-2.625 | smd 1.5 x 4.5: 5 0,-4.275; 6 0,4.325 | drill 0.6 pad 1.2: P$1 0,2.5; P$2 0,-2.5

### Placement (x,y rotation side)
3.3V  60.38,31.5 0 top
3.3V_BACK  48.01,43.5 0 bottom
5V  67.14,35.5 0 top
5V_BACK  25.01,65 0 bottom
+  62.13,2 0 top
-  18.57,2 0 top
AUDIO  75.51,2 0 top
C1  62.01,45 270 top
C2  62.01,53 90 top
C4  15.01,65 270 top
C5  17.26,65.75 270 top
C6  17.26,69.25 90 top
C7  15.01,70 90 top
C9  11.51,50 270 top
C10  15.61,10.7 0 bottom
C16  56.26,33.12 0 top
C17  52.51,36.5 90 top
C18  24.26,37.62 180 top
C19  20.51,38.75 180 top
C24  31.51,62.92 180 top
C28  34.28,63.3 270 top
C29  38.3,59.65 90 top
C33  14.51,48.5 90 top
C39  62.38,32.38 90 top
C40  69.39,32.38 90 top
C41  39.01,37.5 180 top
C43  64.76,43.25 90 top
C45  52.51,44 90 top
C47  64.26,10.5 180 bottom
C48  25.01,34 90 top
C49  25.01,30 270 top
C51  14.67,28.47 90 top
C52  15.51,36.81 0 top
C53  15.51,33.19 0 top
D1  61.51,62.5 90 top
DCJACK  74.96,58.93 0 top
EM6  67.4,51.31 270 top
EM7  65.51,60.5 270 top
EM8  62.01,67 180 top
EM9  12.01,60 0 top
EM10  67.51,65.5 180 top
EXT  2.69,54.48 270 top
F1  78.46,45 90 bottom
F2  65.51,56 90 top
FB1  12.51,67.5 270 top
GND  77.39,24.88 0 top
GND_BACK  70.51,33.5 0 bottom
J1  39.04,69.14 180 top
JP1  79.31,33.5 90 top
JP2  4.1,2 0 top
LOUT  25.26,30 0 bottom
P1  17.17,6.35 270 top
PIN1  19.26,33.88 0 bottom
PIN5  16.01,29.5 0 bottom
PTC1  68.82,47.56 180 top
PUSH  50.15,63 0 top
Q1  71.01,43.75 270 top
R1  58.13,74.38 270 top
R3  52.63,33.75 180 top
R25  62.01,49 90 top
R26  53.51,41 0 top
R27  32.51,37.5 0 top
R30  15.51,35 180 top
R31  20.51,35 180 top
R32  15.51,31.12 180 top
R33  20.51,29 180 top
R36  16.68,28.5 90 top
RA1A  15.51,38.75 0 top
RA1B  20.51,36.88 0 top
RA3A  20.51,70 0 top
RA3B  20.51,68 0 top
RA3C  20.51,66 0 top
RA3D  20.51,64 0 top
ROCKDOWN  46.4,63 0 top
ROUT  25.26,28.38 0 bottom
ROUT1  22.51,27 0 bottom
RST  50.2,33.8 0 top
S01  27.51,34.12 0 bottom
S02  26.57,31.12 0 bottom
SPK+  26.88,40.12 0 bottom
SPK-  24.6,40.12 0 bottom
SW1  70.51,73.53 0 top
U1  38.02,44.91 0 top
U2  20.01,49.5 90 top
U3  20.51,32 0 top
U4  65.89,32.38 180 top
U6  56.01,36.38 90 top
U$1  6.78,34.16 90 top
VCC  76.64,42.88 0 top
VCC_BACK  67.54,59.06 0 bottom
X1  57.01,49 0 top

### Tracks (layer width: path | path; a pad name or v marks a point on that pad's centre or on a via)
!CS1
  Top 0.25: U2.27 17.01,55.48 17.01,52.69 18.54,51.16 U1.110
!MRD
  Top 0.25: U2.1 16.45,42.91 16.45,44.56 22.04,50.16 U1.112
!MWR
  Top 0.25: U2.6 19.2,42.91 19.2,43.94 22.92,47.66 U1.117
+3V3  (via drill 0.34)
  Top 0.203: C28.2 34.28,62.81
  Top 0.25: J1.32 35.79,64.7 | 35.79,64.7 35.79,64.3 | 35.79,64.3 35.79,63.99 35.76,63.96 | 35.76,63.96 35.45,63.65 | 35.45,63.65 35.2,63.4 | 35.2,63.4 34.28,62.49 C28.2 34.26,62.48 | v15.63,47.12 15.51,42.5 16.01,42 19.51,42 19.73,42.23 U2.7 | 38.26,52.66 43.29,52.66 44.82,51.12 49.98,51.12 U1.57 49.99,51.19 48.7,51.19 | 38.26,52.66 35.51,52.66 | 35.51,52.66 U1.107 22.73,52.66 v21.88,52.44 | v35.51,52.25 35.51,52.66 | C29.1 38.27,58.77 U1.85 38.26,52.66 | v35.43,63.96 35.76,63.96 | v35.43,63.96 35.45,63.95 35.45,63.65 | v35.43,63.96 35.43,64.35 | 35.43,64.35 35.79,64.7 | v35.43,63.96 35.43,64.06 35.67,64.3 35.79,64.3 | 35.2,63.4 35.2,64.11 35.43,64.35
  Bottom 0.25: v15.63,47.12 v20.95,52.44 v21.88,52.44 | 35.51,60.5 v35.51,52.25
  other vias: 48.57,51.75 48.57,50.81 47.63,50.81 47.63,51.75 35.51,53.25 22.82,52.44 16.32,47.81 50.01,29.25 50.01,30.25 51.01,29.25 51.01,30.25
  pour Top (isolate 0.25): 22.01,53.5 44.01,53.5 45.51,52 49.51,52 49.51,50.38 45.01,50.38 43.38,52 28.01,52 27.51,51.5 22.01,51.5 20.7,52 20.7,53
  pour Bottom (isolate 0.25): 35.01,52 36.01,52 36.01,60.5 35.71,60.8 35.71,64.3 33.01,64.3 33.01,61 34.01,60 34.01,53
  pour Bottom (isolate 0.25): 20.88,52.69 15.38,47.25 15.38,46.88 15.76,46.88 21.01,52.12 24.01,52.12 24.01,52.69
  pour Top (isolate 0.25): 14.01,48.12 14.01,42 14.51,41.5 20.01,41.5 20.01,43.5 19.51,43.5 19.51,42.5 16.63,42.5 16.63,48.12
  pour Top (isolate 0.25): 49.51,30.5 49.51,27.5 65.89,27.5 65.54,27.84 65.54,31.62 60.13,31.62 60.13,30.5
  pour Bottom (isolate 0.25): 50.51,31.5 51.51,30.5 51.51,29 48.51,29 48.51,45 46.51,47 46.51,52 50.51,52
+5V  (via drill 0.34, 0.35)
  Top 0.203: 72.54,40.9 v73.11,40.9
  Top 0.25: U1.20 39.26,39.25 39.86,38.65 C41.1 39.86,37.85 | 51.5,44.16 U1.43 | v20.26,33 20.51,33 21.02,32.48 U3.9 23.74,32.48 24.41,33.15 C48.1 | 42.36,35.5 49.51,35.5 | 54.36,40.35 R26.2 | 54.36,41.3 R26.2 | 63.01,41 61.51,41 | 61.51,41 R26.2 | 75.85,30.96 JP1.2 | R36.2 16.79,29.25 v17.81,29.25 | 59.51,33.5 61.51,35.5 61.51,41 | 26.51,40.5 29.51,37.5 | EXT.+5V 7.83,52 10.01,52 | 32.29,65.22 J1.39 32.29,64.67 32.79,64.17 J1.38 | 32.68,64.17 32.51,64.35
  Bottom 0.203: v73.11,40.9 73.41,41.2 73.41,48.4 68.21,53.6 66.21,53.6 65.91,53.9 65.91,56.4 64.61,57.7 64.61,72.4 67.01,74.8 SW1.P$3
  Bottom 0.25: v17.81,29.25 18.07,29.51 18.07,30.84 20.23,33 v20.26,33 | 11.51,52 22.75,63.24 | 5V_BACK.TP 25.01,63.5
  other vias: 30.54,61.44 31.48,61.44 13.35,53.19 12.35,53.19 12.35,52.19 13.35,52.19 11.35,52.19 11.35,53.19 30.79,35.28 30.79,36.22 31.7,35.28
  pour Top (isolate 0.25, rank 2): 32.01,68.38 32.01,61.75 29.51,61.75 29.51,61.19 32.78,61.19 32.78,68.38
  pour Bottom (isolate 0.25, rank 2): 32.51,63.75 22.26,63.75 12.01,53.5 7.51,53.5 6.51,52.5 6.51,51.5 7.51,50.5 12.01,50.5 22.7,61.19 32.45,61.19 32.51,61.25
  pour Bottom (isolate 0.25, rank 2): 32.51,36.5 32.51,25 18.51,11 18.51,5.5 18.01,5 16.38,5 15.88,5.5 15.88,11.38 30.51,26 30.51,36.5
  pour Top (isolate 0.25): 18.51,34 18.51,32.5 22.51,32.5 22.51,33.5 21.51,34.5 19.01,34.5
  pour Top (isolate 0.25, rank 5): 7.51,53.5 6.91,52.9 6.91,51.1 7.51,50.5 12.13,50.5 12.13,39.12 25.63,39.12 25.63,34 24.76,34 24.76,29.5 49.26,29.5 49.26,30.75 61.01,30.75 61.01,31.88 62.01,31.88 62.01,33.88 66.51,33.88 66.51,32.12 66.01,31.62 66.01,29 82.14,29 82.14,34.38 73.39,34.38 73.39,41.22 64.79,41.22 64.79,43.53 61.51,43.52 61.51,46.5 54.13,46.5 54.13,44.75 50.63,44.75 50.63,43.12 47.26,39.75 30.76,39.75 28.26,42.25 20.26,42.25 20.26,41.25 14.51,41.25 13.63,42.12 13.63,53.5
A0  (via drill 0.34)
  Top 0.25: U1.9 33.77,44.12 32.76,45.12 v32.45,45.12
  Bottom 0.25: v32.45,45.12 32.76,45.12 34.51,43.38 34.51,21 24.67,11.16 P1.6
A1  (via drill 0.34)
  Top 0.25: U1.10 34.27,44.24 32.63,45.88 v32.63,46.06
  Bottom 0.25: v32.63,46.06 32.63,45.88 35.01,43.5 35.01,20 26.17,11.16 P1.7
A2  (via drill 0.34)
  Top 0.25: U1.11 34.77,44.37 33.63,45.5 33.63,46 v33.57,46
  Bottom 0.25: v33.57,46 33.63,45.94 33.63,45.5 35.51,43.62 35.51,19 27.67,11.16 P1.8
A3  (via drill 0.34)
  Top 0.25: U1.12 35.27,44.49 34.26,45.5 v34.26,46.69
  Bottom 0.25: v34.26,46.69 34.26,45.5 36.01,43.75 36.01,18 29.17,11.16 P1.9
A4  (via drill 0.34)
  Top 0.25: U1.13 35.77,44.62 34.95,45.44 v34.95,45.88
  Bottom 0.25: v34.95,45.88 34.95,45.44 36.51,43.88 36.51,17 30.67,11.16 P1.10
A5  (via drill 0.34)
  Top 0.25: U1.14 36.27,44.74 35.63,45.38 35.63,46.44 v35.38,46.69
  Bottom 0.25: v35.38,46.69 35.63,46.44 35.63,45.38 37.01,44 37.01,16 32.17,11.16 P1.11
A6  (via drill 0.34)
  Top 0.25: v36.32,45.69 36.32,45.31 36.77,44.87 U1.15
  Bottom 0.25: v36.32,45.69 36.32,45.31 37.51,44.12 37.51,15 33.67,11.16 P1.12
A7  (via drill 0.34)
  Top 0.25: U1.16 37.27,45.06 37.01,45.31 37.01,46 36.38,46.62 v36.38,46.69
  Bottom 0.25: v36.38,46.69 36.38,46.62 37.01,46 37.01,45.31 38.01,44.31 38.01,14 35.17,11.16 P1.13
A8  (via drill 0.34)
  Top 0.25: U1.17 37.76,45.25 37.45,45.56 37.45,46.62 v37.32,46.69
  Bottom 0.25: v37.32,46.69 37.45,46.56 37.45,45.56 38.51,44.5 38.51,12.5 36.67,10.66 P1.14
A9  (via drill 0.34)
  Top 0.25: U1.18 38.26,46 v38.13,45.88
  Bottom 0.25: v38.13,45.88 39.01,45 39.01,11.5 38.17,10.66 P1.15
A10  (via drill 0.34)
  Top 0.25: U1.21 39.76,46.81 v39.57,47
  Bottom 0.25: v39.57,47 39.51,46.62 39.51,8.5 39.67,8.34 P1.16
A11  (via drill 0.34)
  Top 0.25: U1.22 40.26,46.44 v40.51,46.69
  Bottom 0.25: v40.51,46.69 40.51,46.56 40.01,46.06 40.01,11.5 41.17,10.34 P1.17
A12  (via drill 0.34)
  Top 0.25: U1.23 40.76,45.69 v40.95,45.88
  Bottom 0.25: v40.95,45.88 40.51,45.44 40.51,12.5 42.67,10.34 P1.18
A13  (via drill 0.34)
  Top 0.25: U1.24 41.26,45.12 41.63,45.5 41.63,46.5 v41.45,46.69
  Bottom 0.25: v41.45,46.69 41.63,46.5 41.63,45.5 41.01,44.88 41.01,14 44.17,10.84 P1.19
A14  (via drill 0.34)
  Top 0.25: U1.25 41.76,44.94 42.13,45.31 42.13,46.31 v42.51,46.69
  Bottom 0.25: v42.51,46.69 42.13,46.31 42.13,45.31 41.51,44.69 41.51,15 45.67,10.84 P1.20
A15  (via drill 0.34)
  Top 0.25: U1.26 42.26,44.81 42.63,45.19 42.63,45.56 v42.82,45.75
  Bottom 0.25: v42.82,45.75 42.63,45.56 42.63,45.19 42.01,44.56 42.01,16 47.17,10.84 P1.21
BATT
  pour Bottom (isolate 0.25, rank 2): 59.51,-1 59.51,4 60.01,4.5 68.01,4.5 71.76,8.25 71.76,18.73 75.89,23.25 75.89,44.75 83.01,44.75 83.01,0 81.51,-1.5 60.01,-1.05
BATT_DC
  pour Top (isolate 0.25, rank 3): 75.76,56.5 75.76,54.08 66.01,54.08 66.01,51.5 82.04,51.5 82.04,56.5
CK1
  Top 0.25: U1.52 52.85,48.66 54.51,47 X1.4 | X1.5 57.01,46.27 56.9,46.38
  Top 0.5: X1.4 56.9,46.38 X1.1 59.53,45.85 C1.1 R25.1
CK2
  Top 0.203: X1.6 57.01,51.73 56.9,51.62
  Top 0.25: U1.53 52.79,49.16 54.01,50.38 54.51,50.62 X1.3
  Top 0.5: X1.3 56.9,51.62 X1.2 59.53,52.15 C2.1 R25.2
CLK  (via drill 0.34)
  Top 0.25: U1.5 31.76,41.68 v32.01,41.94
  Bottom 0.25: v32.01,41.94 33.01,40.94 33.01,37.88 32.01,36.88 32.01,36.06 32.51,35.56 32.51,25 18.67,11.16 P1.2
CLS
  Top 0.25: J1.7 48.29,60.03 45.77,57.51 U1.70
CS  (via drill 0.34)
  Top 0.25: U1.8 33.27,43.62 v32.7,44.19
  Bottom 0.25: v32.7,44.19 34.01,42.88 34.01,22 23.17,11.16 P1.5
D0  (via drill 0.34)
  Top 0.25: U1.27 42.76,44.44 v43.29,44.97
  Bottom 0.25: v43.29,44.97 42.51,44.19 42.51,17 48.67,10.84 P1.22
D1  (via drill 0.34)
  Top 0.25: U1.28 43.26,43.94 44.01,44.69 44.01,45.5 v43.76,45.75
  Bottom 0.25: v43.76,45.75 44.01,45.5 44.01,44.69 43.01,43.69 43.01,18 50.17,10.84 P1.23
D2  (via drill 0.34)
  Top 0.25: U1.29 43.76,43.75 44.45,44.44 44.45,46.12 43.88,46.69 v43.76,46.69
  Bottom 0.25: v43.76,46.69 43.88,46.69 44.45,46.12 44.45,44.44 43.51,43.5 43.51,19 51.67,10.84 P1.24
D3  (via drill 0.34)
  Top 0.25: U1.30 44.26,43.56 44.88,44.19 44.88,45.69 v45.2,46
  Bottom 0.25: v45.2,46 44.88,45.69 44.88,44.19 44.01,43.31 44.01,20 53.17,10.84 P1.25
D4  (via drill 0.34)
  Top 0.25: U1.31 44.76,43.38 45.32,43.94 45.32,44.62 45.82,45.12 v45.82,45.19
  Bottom 0.25: v45.82,45.19 45.32,44.69 45.32,43.94 44.51,43.12 44.51,21 54.67,10.84 P1.26
D5  (via drill 0.34)
  Top 0.25: U1.32 45.27,43.19 45.95,43.88 45.95,44 v46.01,44.06
  Bottom 0.25: v46.01,44.06 46.01,43.94 45.01,42.94 45.01,22 56.17,10.84 P1.27
D6  (via drill 0.34)
  Top 0.25: U1.33 45.77,42.63 v46.13,43
  Bottom 0.25: v46.13,43 45.51,42.38 45.51,23 57.67,10.84 P1.28
D7  (via drill 0.34)
  Top 0.25: U1.34 46.27,41.94 v46.45,42.12
  Bottom 0.25: v46.45,42.12 46.01,41.69 46.01,24 59.17,10.84 P1.29
DC_JACK  (via drill 0.35)
  Top 0.25: JP1.3 74.76,33.5 v74.14,34.12
  other vias: 68.01,56 75.14,34.12 75.14,32.5 74.14,32.5 74.64,33.31 67.04,56 68.01,54.38 67.04,54.38 67.51,55.16
  pour Top (rank 2): 79.64,34.38 79.64,32.25 73.89,32.25 73.89,34.38
  pour Bottom (isolate 0.25, rank 2): 73.89,32.25 75.39,32.25 75.39,49.12 68.26,56.25 66.39,56.25 66.39,54.12 68.39,54.12 73.89,48.62
  pour Top (isolate 0.25, rank 2): 64.73,56.25 68.26,56.25 68.26,54.12 64.73,54.12
DCK
  Top 0.25: 33.77,65.87 J1.36 33.79,65.14 33.48,64.83 33.48,58.73 33.77,58.45 U1.94
ELP2  (via drill 0.34)
  Top 0.25: v9.76,68.15 9.91,68.15 10.54,68.78 FB1.1
  Bottom 0.25: v9.76,68.15 9.56,67.95 9.56,63.85 3.47,57.76 3.47,54.29 5.69,52.07 EXT.OUT
ELP3  (via drill 0.34)
  Top 0.25: v10.7,67.94 10.74,67.9 FB1.2
  Bottom 0.25: EXT.IN 7.54,54.48 6.31,53.25 5.2,53.25 3.97,54.48 3.97,57.62 10.05,63.69 10.05,67.41 10.58,67.94 v10.7,67.94
ELP4  (via drill 0.34)
  Top 0.25: v10.7,66.99 10.75,66.99 10.86,67.1 FB1.3
  Bottom 0.25: v10.7,66.99 10.55,66.84 10.55,63.59 4.5,57.54 4.5,55.4 5.42,54.48 EXT.SD
ELP5  (via drill 0.34)
  Top 0.25: v11.41,65.34 11.41,66.22 FB1.4
  Bottom 0.25: EXT.CLK 7.69,60.08 11.06,63.45 11.06,64.99 v11.41,65.34
EM10_EM8
  pour Top (isolate 0.25, rank 5): 62.25,68.81 62.25,65.5 67.01,65.5 67.01,68.81
EM10_GND  (via drill 0.34)
  other vias: 70.57,68.5 68.57,68.5 67.89,67.56 67.89,66.31
  pour Bottom (isolate 0.25, rank 2): 67.45,68.81 67.45,58.62 67.89,58.19 67.89,58.12 72.76,58.12 72.76,62 71.76,62 71.76,68.81
  pour Top (isolate 0.25, rank 2): 67.45,68.81 67.45,65.75 70.86,65.75 70.86,68.81
EM10_POS
  pour Top (isolate 0.25): 67.45,65.25 67.45,57 81.51,57 81.51,62 70.86,62 70.86,65.25
GND  (via drill 0.33, 0.34)
  Top 0.25: C41.2 38.16,38.65 38.76,39.25 U1.19 38.76,43.31 39.01,43.56 39.01,46 38.88,46.12 | C45.2 52.32,44.66 U1.44 | v38.48,61.7 38.31,61.52 38.31,60.51 C29.2 38.3,60.26 39.13,59.52 39.13,58.07 38.76,57.69 U1.84 38.77,55.01 v39.01,55 | v20.63,31.03 20.38,31.03 19.74,31.48 U3.4 | U2.21 20.29,56.91 v19.88,57.31 | v35.51,67.5 35.29,67.28 J1.33 35.29,65.05 34.79,64.55 | U1.108 29.35,52.16 29.51,52 v29.51,51.19 | C5.2 17.26,64.25 v18.51,63 | C7.2 14.54,70.85 | C1.2 63.16,44.15 v63.26,45.38 | U1.49 51.04,47.16 | U1.50 51.48,47.66 v51.51,47.88 50.98,48.16 U1.51 | U1.54 50.98,49.66 51.26,49.94 | 51.26,49.94 51.04,50.16 U1.55 | 51.26,49.94 v51.38,49.94 | U1.59 50.05,52.12 51.13,52.12 v51.38,51.88 51.17,51.66 U1.58 | 34.79,66.03 34.78,66.03 | 34.78,66.03 34.78,66.97 34.96,66.97 | 34.29,69.12 35.29,70.12 | v21.9,33.8 21.7,34 20.01,34 19.51,33.5 19.51,32.88 19.11,32.48 U3.2 | v53.63,36.62 53.55,36.62 52.82,37.35 C17.2 | C16.2 56.96,33.27 56.96,34.19 | 56.96,34.19 U6.3 | v58.13,34.19 56.96,34.19 | J1.34 34.76,65.92 34.76,66 | J1.34 34.79,64.55 | C28.1 34.38,64.15 34.79,64.55 | J1.34 34.78,66.03 | v23.73,29.03 23.85,29.15 23.86,29.15 23.74,29.03 v23.73,29.03
  Top 0.27: 35.29,67.39 35.29,70.12 | 35.39,68.11 35.39,67.49 35.29,67.39 | J1.34 34.79,66.89 35.29,67.39 | U1.51 48.38,48.16 | U1.50 48.6,47.66 | U1.49 48.57,47.16 | U1.44 48.73,44.66 | U1.54 48.57,49.66 | C48.2 23.7,34.84
  Bottom 0.25: v19.88,57.31 14.51,51.94 v14.76,50.56 14.7,50.5 14.46,49.35 11.99,49.35 v11.38,47.75 | v38.48,61.7 38.51,61.73 38.51,67.5 | 38.51,67.5 38.51,70.5 42.01,74 47.51,74 50.26,71.25 v50.26,71 | 38.51,67.5 v35.51,67.5 35.51,70.25 32.76,73 31.51,73 30.01,71.5 30.01,65.06 | v63.26,53.31 v63.26,45.38 | v51.38,51.88 51.32,51.81 v51.38,49.94 51.51,49.75 v51.51,47.88 | 28.82,33.89 28.51,34.2 | 28.82,33.11 28.72,33.01
  other vias: 23.61,34.75 13.57,71.81 30.31,64.38 21.38,30.5 20.2,30.19 22.6,29.34 23.6,36.16 35.51,70.5 37.51,70.5 48.26,71 48.26,67.5 49.76,67.5 59.51,68.5 59.51,66.5 13.57,72.81 12.57,72.81 12.57,71.81 18.57,71.81 18.57,72.81 19.57,72.81 19.57,71.81 18.51,62 19.51,62.5 13.51,63 12.51,63 13.51,61.5 12.51,61.5 20.82,58.25 21.76,59.19 14.76,51.56 15.76,51.56 15.76,50.56 15.76,49.56 9.88,47.75 9.88,49.62 63.26,46.38 64.26,46.38 64.26,45.38 63.26,54.31 60.76,54.81 60.76,53.81 59.76,53.81 59.76,54.81 51.38,50.88 52.38,51.88 52.38,50.88 52.38,49.94 51.51,46.88 51.51,45.88 52.51,46.88 52.51,47.88 30.13,50.5 31.38,50.5 30.76,51.19 32.01,51.19 40.38,55 39.7,54.25 29.7,54.25 31.7,54.25 64.01,9.25 65.01,9.25 65.01,6.38 64.01,6.38 9.82,69.38 49.63,61.64 48.13,57.94 50.76,64.44 62.01,57.5 65.26,51.81 65.26,49.81 65.26,47.81 66.39,43.75 55.51,53.56 35.51,51.19 38.51,51.19 41.51,51.19 44.01,50.19 45.51,47.69 1.51,9.5 1.51,23 1.51,32.5 1.51,42.5 74.96,77.6 14.01,2.5 26.36,0.8 30.36,0.8 35.36,0.8 40.36,0.8 45.36,0.8 50.36,0.8 54.36,0.8 8.01,23 11.51,23 16.51,23 21.51,23 16.51,17.5 8.01,17.5 5.61,9.5 11.51,12.5 5.61,5.8 8.01,27.5 6.51,42.5 6.51,37.15 6.51,47.5 51.51,72.7 56.51,62.5 56.51,57.5 56.51,22.5 61.51,22.5 66.51,22.5 61.51,17.5 66.51,17.5 66.51,12.5 61.51,12.5 51.51,22.5 56.51,17.5 21.51,26.25 26.51,26.25 51.51,26.25 56.51,26.25 61.51,26.25 66.51,26.25 11.38,42.5 79.26,77.6 79.01,69.8 31.51,75 36.51,75 41.51,75 46.51,75 51.51,75 26.51,75 21.51,75.15 11.51,75.15 1.51,75.15 12.26,55.75 14.76,58.25 49.26,55.75 71.51,22.5 73.01,69.8 61.51,68.5 63.26,44.38 37.51,55 36.76,54.25 24.75,36.16 65.76,32.38 64.64,32.38 63.51,32.38 73.76,28.25 75.01,28.25 75.01,27 73.76,27 75.01,25.75 73.76,25.75 75.01,24.5 73.76,24.5 66.39,44.84 1.57,69.88 22.86,4.92 57.86,4.92 54.36,4.92 26.36,4.92 23.73,30.16 58.11,72.3 58.11,70.9 55.31,70.9 55.31,72.3 63.81,69.6 67.81,69.6 69.01,71.3 71.81,73.5 54.11,77.5 52.36,67.3 68.41,73.5 70.2,42.12 37.51,67.5 39.51,67.5 41.51,67.5 43.51,67.5 39.51,70.5 41.51,70.5 43.51,70.5 66.41,75.5 8.01,31.1 10.91,33.2 4.41,23 8.41,2.5 47.65,53 47.65,54.75 8.76,58.5 8.76,55.75 6.82,69.88
  pour Top (isolate 0.25, rank 6): -3.49,80.5 -3.49,-1 -1.99,-2.5 84.01,-2.5 85.51,-1 85.51,78.5 83.51,80.5 0.51,80.5 -0.99,82 -1.99,82
  pour Bottom (isolate 0.25, rank 5): -4.99,85 86.51,85 90.51,81 90.51,-4.5 86.01,-9 -6.99,-9 -14.49,-1.5 -14.49,75.5
  pour Top (rank 2): 62.01,32.03 62.01,33.62 66.26,33.62 66.26,32.88 68.14,32.88 68.14,33.62 69.76,33.62 69.76,32.25 68.26,32.25 68.04,32.03
HP_SWITCH  (via drill 0.34)
  Top 0.25: U3.3 18.32,32 v20.38,32 | v75.57,4 75.76,4.19 75.76,11.5 73.01,14.25 73.01,22.62 68.14,27.5 18.76,27.5 v18.51,27.75 18.41,27.65 R36.1 16.65,27.62 C51.1
  Bottom 0.25: v20.38,32 20.13,32 18.63,30.5 18.63,27.88 v18.51,27.75 | v75.57,4 73.14,4 71.7,2.56 AUDIO.1
LDB0
  Top 0.25: U1.86 37.77,57.83 37.43,58.17 37.43,61.74 38.79,63.1 J1.26
LDB1
  Top 0.25: U1.87 37.27,57.71 36.99,57.98 36.99,61.95 38.29,63.25 J1.27
LDB2
  Top 0.25: U1.88 36.77,57.58 36.54,57.81 36.54,62.16 37.79,63.4 J1.28
LDB3
  Top 0.25: U1.89 36.27,57.46 36.09,57.63 36.09,62.35 37.29,63.55 J1.29
LDB4
  Top 0.25: U1.90 35.77,57.33 35.64,57.46 35.64,62.55 36.79,63.7 J1.30
LDB5
  Top 0.25: U1.91 35.27,57.23 35.19,57.31 35.19,62.73 36.29,63.83 J1.31
LDG0
  Top 0.25: U1.78 41.79,56.43 J1.20
LDG1
  Top 0.25: J1.21 41.29,60.56 41.3,60.55 41.3,57.17 41.27,57.13 U1.79
LDG2
  Top 0.25: U1.80 40.79,56.43 40.76,56.46 40.76,56.62 40.79,56.65 40.79,57.24 40.88,57.33 40.88,60.27 40.79,60.36 J1.22
LDG3
  Top 0.25: U1.81 40.29,56.43 40.26,56.46 40.26,57.32 40.45,57.51 40.45,60.04 40.29,60.2 J1.23
LDG4
  Top 0.25: U1.82 39.79,56.43 39.76,56.46 39.76,57.44 40.01,57.69 40.01,59.86 39.79,60.09 J1.24
LDG5
  Top 0.25: U1.83 39.26,57.57 39.57,57.88 39.57,59.69 39.29,59.97 J1.25
LDR0
  Top 0.25: U1.72 44.79,56.43 J1.14
LDR1
  Top 0.25: J1.15 44.27,65.87 U1.73
LDR2
  Top 0.25: U1.74 43.79,56.43 J1.16
LDR3
  Top 0.25: J1.17 43.27,65.87 U1.75
LDR4
  Top 0.25: U1.76 42.79,56.43 J1.18
LDR5
  Top 0.25: U1.77 42.29,56.43 J1.19
LIN_AMP  (via drill 0.34)
  Top 0.25: R31.2 18.79,35 18.31,34.52 U3.1 18.31,34.42 18.14,34.59 | R30.1 17.73,35 18.14,34.59 | v18.38,34.59 18.14,34.59
  Bottom 0.25: v18.38,34.59 18.38,34.51 19.01,33.88 PIN1.TP
LP  (via drill 0.35)
  Top 0.25: U1.93 34.27,59.87 v34.4,60 | J1.35 34.29,67.49 v34.5,67.7
  Bottom 0.25: v34.4,60 34.18,60.22 34.18,67.39 v34.5,67.7
MA0  (via drill 0.34)
  Top 0.25: U1.99 31.26,57.97 v31.07,58.19 | U2.17 22.48,56.69 23.48,57.69 24.32,57.69 26.42,59.78 v26.42,60.09
  Bottom 0.25: v31.07,58.19 29.79,59.44 27.07,59.44 v26.42,60.09
MA1  (via drill 0.34)
  Top 0.25: U1.98 31.76,57.81 v31.98,58.03 | U2.16 23.04,56.59 23.7,57.25 24.57,57.25 27.35,60.03 v27.35,60.5
  Bottom 0.25: v31.98,58.03 31.98,58.22 30.2,60 28.01,60 27.51,60.5 v27.35,60.5
MA2  (via drill 0.34)
  Top 0.25: U1.97 32.26,55.44 31.85,55.03 v30.85,55.03 | v24.54,56.47 24.32,56.69 23.76,56.69 23.58,56.51 U2.15
  Bottom 0.25: v30.85,55.03 30.57,55.31 29.6,55.31 28.26,56.66 28.26,57.06 27.73,57.59 26.26,57.59 25.13,56.47 v24.54,56.47
MA3
  Top 0.25: U1.124 27.99,44.19 24.2,44.19 23.58,43.58 U2.14
MA4
  Top 0.25: U2.13 23.07,42.94 23.07,43.75 23.98,44.66 U1.123
MA5
  Top 0.25: U2.12 22.51,42.92 22.51,43.88 23.79,45.16 U1.122
MA6
  Top 0.25: U2.11 21.95,42.91 21.95,44 23.61,45.66 U1.121
MA7
  Top 0.25: U2.10 21.38,44.12 23.42,46.16 U1.120
MA8
  Top 0.25: U2.4 18.07,42.91 18.07,44.12 22.61,48.66 U1.115
MA9
  Top 0.25: U2.3 17.51,42.92 17.51,44.25 22.42,49.16 U1.114
MA10
  Top 0.25: U2.28 16.45,54.99 16.45,52.56 18.35,50.66 U1.111
MA11
  Top 0.25: U2.2 17.01,42.92 17.01,44.44 22.23,49.66 U1.113
MA12
  Top 0.25: U2.9 20.82,42.91 20.82,44.25 23.23,46.66 U1.119
MD0  (via drill 0.34)
  Top 0.25: U1.100 30.76,57.38 v30.13,58 | U2.18 21.95,56.01 21.95,56.84 23.26,58.16 24.1,58.16 25.42,59.47 v25.42,59.78
  Bottom 0.25: v30.13,58 30.13,57.88 29.04,58.97 26.57,58.97 25.76,59.78 v25.42,59.78
MD1  (via drill 0.34)
  Top 0.25: U1.101 30.26,55.44 29.95,55.12 29.38,55.12 29.01,55.5 v29.01,56.91 | v23.67,58.84 23.26,58.84 21.38,56.97 U2.19
  Bottom 0.25: v29.01,56.91 28.92,57.09 27.95,58.06 24.45,58.06 v23.67,58.84
MD2  (via drill 0.34)
  Top 0.25: U1.102 29.76,57.25 v29.2,57.81 | U2.20 20.83,57.2 23.2,59.56 24.45,59.56 v24.42,59.47
  Bottom 0.25: v29.2,57.81 28.48,58.53 25.35,58.53 v24.42,59.47
MD3
  Top 0.25: U2.22 19.76,55.48 19.76,55.31 20.41,54.66 U1.103
MD4
  Top 0.25: U2.23 19.2,55.3 19.2,55.06 20.1,54.16 U1.104
MD5
  Top 0.25: U2.24 18.63,54.81 19.79,53.66 U1.105
MD6
  Top 0.25: U2.25 18.07,54.99 18.07,54.56 19.48,53.16 U1.106
MD7
  Top 0.25: U2.26 17.57,55.96 17.57,52.88 18.79,51.66 U1.109
N$1  (via drill 0.34)
  Top 0.25: FB1.8 14.63,68.78 C7.1 15.41,68.75 v16.11,68.75 | v18.46,69.25 19.21,70 RA3A.1
  Bottom 0.25: v18.46,69.25 18.46,69.15 18.06,68.75 v16.11,68.75
N$2
  Top 0.25: RA3B.1 19.51,68.15 17.26,68.15 C6.1 16.76,67.9 FB1.7
N$4
  Top 0.25: C52.2 16.36,36.7 R30.2
N$5
  Top 0.25: C53.2 14.66,31.49 R32.2
N$6
  Top 0.25: 13.36,67 FB1.6 16.76,67.1 C5.1 17.26,66.85 18.56,66.85 19.41,66 RA3C.1
N$7
  Top 0.25: C52.1 14.43,36.81 U$1.P$3
N$8
  Top 0.25: U1.6 32.27,37.85 31.91,37.5 R27.1
N$9  (via drill 0.34)
  Top 0.25: v16.11,66.25 15.41,66.25 C4.1 14.63,66.22 FB1.5 | v18.46,65.75 18.46,64.8 19.26,64 RA3D.1
  Bottom 0.25: v18.46,65.75 18.46,65.85 18.06,66.25 v16.11,66.25
N$10
  Top 0.25: C53.1 13.34,33.19 12.32,32.16 U$1.P$2
N$11
  Top 0.25: R1.1 58.13,75.72 60.39,77.98 71.33,77.98 SW1.P$4
N$13
  pour Top (isolate 0.25, rank 3): 60.01,62.62 60.01,59.38 67.51,59.38 67.51,62.62
N$15
  pour Top (isolate 0.25, rank 2): 64.01,60.31 67.01,60.31 67.01,56.75 64.01,56.75
N$16
  pour Top (rank 2): 66.01,51 66.01,46.25 68.76,46.25 68.76,51
N$24
  Top 1: EXT.GND 5.63,56.99 5.63,58.37 7.26,60 EM9.1
N$29
  Top 0.25: C49.1 24.26,30.85 23.62,31.48 U3.7
P00  (via drill 0.34)
  Top 0.25: U1.1 29.76,46.25 32.01,48.5 v32.01,49.5 | v31.88,67.5 31.29,66.9 J1.41
  Bottom 0.25: v31.88,67.5 32.2,67.19 32.2,59.11 33.01,58.3 33.01,50.69 32.26,49.94 32.26,49.62 v32.01,49.5
P01  (via drill 0.34)
  Top 0.25: U1.4 31.26,45.69 32.38,46.81 32.88,46.81 34.51,48.44 v34.51,48.75 | J1.42 30.79,67.53 31.57,68.31 32.45,68.31 v33.45,69.31
  Bottom 0.25: v33.45,69.31 33.45,68.71 33.7,68.46 33.7,59.67 34.51,58.86 v34.51,48.75
P02  (via drill 0.34)
  Top 0.25: U1.3 30.76,45.88 32.2,47.31 32.63,47.31 33.63,48.31 v33.63,49.03 | v32.45,69.31 31.95,68.81 31.35,68.81 30.29,67.75 J1.43
  Bottom 0.25: v33.63,49.03 33.82,49.06 33.82,49.31 34.01,49.5 34.01,58.67 33.2,59.49 33.2,68.16 32.45,68.91 v32.45,69.31
P03  (via drill 0.34)
  Top 0.25: U1.2 30.26,46.06 32.7,48.5 v32.7,48.62 | v31.45,69.81 29.79,68.15 J1.44
  Bottom 0.25: v31.45,69.81 31.45,69.11 32.7,67.86 32.7,59.3 33.51,58.49 33.51,50.06 32.7,49.25 v32.7,48.62
P10  (via drill 0.34)
  Top 0.25: v25.51,43.5 25.67,43.66 U1.125 | v28.23,55.66 28.26,55.75 28.26,58.12 29.51,59.38 29.51,62.75 29.29,62.97 J1.45
  Bottom 0.25: v25.51,43.5 25.51,55.5 26.23,56.22 27.67,56.22 v28.23,55.66
P11  (via drill 0.34)
  Top 0.25: U1.126 27.99,43.19 26.2,43.19 v25.51,42.5 | v27.13,56.91 27.79,57.38 27.79,58.34 29.04,59.59 29.04,62.5 28.79,62.75 J1.46 28.79,65.36
  Bottom 0.25: v25.51,42.5 24.76,43.25 24.76,43.84 25.01,44.09 25.01,55.69 26.32,57 27.01,57 v27.13,56.91
P12  (via drill 0.34)
  Top 0.25: v26.51,41.56 27.01,41.56 27.61,42.16 U1.128 | v27.32,55.53 26.45,56.41 26.45,57.72 28.57,59.84 28.57,62.26 28.29,62.54 J1.47
  Bottom 0.25: v26.51,41.56 27.01,41.56 27.51,42.06 27.51,43.72 26.51,44.72 26.51,54.5 27.32,55.31 v27.32,55.53
P13  (via drill 0.34)
  Top 0.25: v26.51,42.5 26.61,42.66 U1.127 | v26.42,55.41 26.01,55.81 26.01,58 28.07,60.06 28.07,62.03 27.79,62.32 J1.48
  Bottom 0.25: v26.51,42.5 26.51,44 26.01,44.5 26.01,55 v26.42,55.41
PFET_DRAIN
  Top 0.25: 69.89,45.88 70.26,45.88
  pour Top (isolate 0.25, rank 4): 66.01,51.5 66.01,46.25 69.26,46.25 69.26,43.75 73.14,43.75 73.14,51.5
PUSH
  Top 0.25: PUSH.TP 49.79,63.36 J1.4
R4  (via drill 0.34)
  Top 0.25: U1.96 32.76,58.44 v31.23,59.96 | RA3C.2 22.36,66 23.36,65 23.36,63.15 v24.57,61.94
  Bottom 0.25: v31.23,59.96 30.7,60.5 28.51,60.5 27.76,61.25 26.26,61.25 25.57,61.94 v24.57,61.94
RA0
  Top 0.25: U2.5 18.63,44 22.79,48.16 U1.116
RA1
  Top 0.25: U2.8 20.32,42.94 20.32,44.38 23.11,47.16 U1.118
RA1-S01
  Top 0.25: C19.2 RA1A.2
RA1-S02
  Top 0.25: C18.2 23.16,37.38 21.86,37.38 RA1B.2
RD  (via drill 0.34)
  Top 0.25: U1.7 32.77,43.06 v32.57,43.25
  Bottom 0.25: v32.57,43.25 33.51,42.31 33.51,23 21.67,11.16 P1.4
RES  (via drill 0.34)
  Top 0.25: v47.32,41.81 46.77,41.26 U1.35 | v62.45,11.5 61.79,10.84 v60.67,10.84 | U6.1 54.93,35.25 52.91,35.25 C17.1 52.51,34.88 51.78,34.15 R3.2 50.4,33.75 | v48.73,34.28 49.26,33.75 50.4,33.75 | RST.TP 50.35,33.8 50.4,33.75
  Bottom 0.25: v60.67,10.84 46.51,25 46.51,41 v47.32,41.81 48.01,41.12 48.01,39.03 49.01,38.03 49.01,36.5 48.51,36 48.51,34.5 v48.73,34.28 | v60.67,10.84 P1.30 | v60.67,10.84 60.64,10.81 | C47.1 62.45,11.46 v62.45,11.5
RIN_AMP  (via drill 0.34)
  Top 0.25: R33.2 19.66,29.64 U3.5 17.38,30.98 | R32.1 16.5,30.98 17.38,30.98 | 17.38,30.98 17.36,30.96 v17.36,30.4
  Bottom 0.25: v17.36,30.4 16.91,30.4 PIN5.TP
ROCK_DOWN
  Top 0.25: ROCKDOWN.TP 46.79,63.64 J1.10
ROUT  (via drill 0.34, 0.35)
  Top 0.25: U3.6 22.71,30.73 21.36,29.39 R33.1 22.23,28.12 22.57,28.12 v22.57,28.15 | AUDIO.3 76.76,2.02 76.76,11.25 73.51,14.5 73.51,22.81 68.32,28 27.1,28 26.82,28.28 v26.44,28.28
  Bottom 0.203: ROUT1.TP 22.51,28.09 v22.57,28.15
  Bottom 0.25: v22.57,28.15 25.04,28.15 ROUT.TP 26.1,28.38 26.19,28.28 v26.44,28.28
RPP
  pour Top (isolate 0.25, rank 2): 60.01,65.5 67.01,65.5 67.01,62.75 60.01,62.75
S01  (via drill 0.34)
  Top 0.25: U1.37 47.76,39.56 48.01,39.31 48.01,38.5 v47.76,38.25 | v26.7,38.75 C19.1 | v47.76,29.69 47.57,29.5 28.76,29.5 v27.7,30.56
  Bottom 0.25: v47.76,38.25 47.51,38 47.51,30 v47.76,29.69 | v27.7,30.56 27.63,30.62 27.63,34.12 S01.TP 26.88,34.75 26.88,37 27.35,37.46 27.35,38.1 v26.7,38.75
S02  (via drill 0.34)
  Top 0.25: U1.38 48.26,39.81 48.51,39.56 48.51,37.69 v48.32,37.5 | C18.1 26.51,37.62 v26.7,37.81 | v27.01,29.88 27.88,29 48.2,29 v48.7,29.5
  Bottom 0.203: 26.54,33.39 26.45,33.48
  Bottom 0.25: v48.32,37.5 48.01,37.19 48.01,30.5 48.51,30 48.51,29.69 v48.7,29.5 | v27.01,29.88 26.51,30.38 26.51,31.06 S02.TP 26.76,31.31 26.76,31.5 27.16,31.9 27.16,32.77 26.54,33.39 | 26.45,33.48 26.45,37.56 v26.7,37.81
SCK  (via drill 0.34)
  Top 0.25: R26.1 52.66,41.1 51.13,42.62 50.05,42.62 U1.40 49.98,42.62 47.88,42.62 47.01,43.5 47.01,44 46.51,44.5 46.51,45.88 v46.38,46 | v45.26,71.44 45.05,71.65 31.26,71.65 26.36,66.75 25.51,66.75 v25.16,66.4 | v22.61,64.6 22.21,64.6 21.61,64 RA3D.2
  Bottom 0.25: v45.26,71.44 45.76,70.94 45.76,49.62 46.59,48.8 46.59,46.2 v46.38,46 | v25.16,66.4 24.66,66.4 22.86,64.6 v22.61,64.6
SIN  (via drill 0.34)
  Top 0.25: 21.51,67.85 RA3B.2 22,68 22.8,67.2 26.15,67.2 31.09,72.14 45.87,72.14 v46.07,71.94 | U1.41 48.1,43.16 47.51,43.75 47.51,44.5 47.2,44.81 v47.2,45.12
  Bottom 0.25: v47.2,45.12 47.07,45.25 47.07,49 46.26,49.81 46.26,71.75 v46.07,71.94
SOUT  (via drill 0.34)
  Top 0.25: U1.42 48.41,43.66 48.01,44.06 48.01,45.5 47.76,45.75 v47.76,45.88 | v46.95,72.19 46.74,72.19 46.34,72.59 30.89,72.59 25.94,67.64 23.01,67.64 22.4,68.25 22.4,69.21 21.61,70 RA3A.2
  Bottom 0.25: v46.95,72.19 46.95,71.56 46.76,71.38 46.76,50 47.56,49.2 47.56,46.08 v47.76,45.88
SPK+  (via drill 0.34)
  Top 0.25: v24.6,60.56 25.6,60.56 27.29,62.25 J1.49 | U3.8 22.72,32 26.01,32 v26.51,32.5
  Bottom 0.203: SPK+.TP 25.98,40.12
  Bottom 0.25: v24.6,60.56 23.57,60.56 22.98,59.97 22.98,56.91 24.51,55.38 24.51,44.47 24.23,44.19 24.23,42.78 25.98,41.03 25.98,40.12 25.98,33 26.48,32.5 v26.51,32.5
SPK-  (via drill 0.34)
  Top 0.25: R31.1 21.73,35 22.71,34.02 U3.10 22.72,33 23.51,33 23.79,33.28 v23.79,33.69 | v26.26,29.22 26.51,28.97 26.88,28.97 27.35,28.5 68.51,28.5 74.01,23 74.01,14.75 79.26,9.5 79.26,2.5 79.51,2.25 79.51,2.19 AUDIO.4 | J1.50 26.79,62.78 v25.26,61.25
  Bottom 0.203: SPK-.TP 25.51,40.12
  Bottom 0.25: v25.26,61.25 23.51,61.25 22.51,60.25 22.51,56.62 24.01,55.12 24.01,44.66 23.73,44.38 23.73,42.5 25.51,40.72 25.51,40.12 25.51,35.41 v23.79,33.69 25.26,32.22 LOUT.TP 25.35,30 26.13,29.22 v26.26,29.22
SPL
  Top 0.25: U1.71 45.29,56.43 J1.13
SPS
  Top 0.25: J1.6 48.79,59.87 46.27,57.35 U1.69
SW1B
  pour Bottom (isolate 0.25, rank 3): 75.89,44.75 75.89,49.38 71.76,53.5 71.76,58.12 80.01,58.12 81.01,57.12 81.01,44.75
VCC  (via drill 0.35)
  other vias: 76.26,49.25 76.26,48.12 76.26,47 76.26,45.88
  pour Top (isolate 0.25): 73.26,51 73.26,43.12 71.26,43.12 71.26,41.75 73.89,41.75 73.89,34.88 81.99,34.88 82.01,51
  pour Bottom (isolate 0.25): 75.89,45.25 75.89,49.38 68.51,56.75 66.26,56.75 65.14,57.88 65.14,72.25 66.95,72.25 66.95,59.44 68.01,58.38 72.73,58.38 72.73,53.77 76.64,49.88 76.64,45.25
VCC_SW  (via drill 0.34, 0.35)
  Top 0.25: v79.65,56.7 79.85,56.5 79.85,39.12 JP1.5 | SW1.P$1 68.71,72.26 67.31,70.86 63.87,70.86 v63.7,70.7 | v51.51,71.6 51.29,71.38 51.29,69.4 | 51.29,69.4 J1.1 | J1.2 50.79,68.9 51.29,69.4
  Bottom 0.25: v79.65,56.7 79.86,56.91 79.86,70.14 79.36,70.64 72.62,70.64 71,72.26 SW1.P$1 | v63.7,70.7 61.71,70.7 60.81,71.6 v51.51,71.6
VIN  (via drill 0.34)
  Top 0.25: U1.36 v47.27,39.01 v47.26,39
  Bottom 0.25: v47.27,39.01 47.01,38.75 47.01,25.88 62.17,10.71 P1.31
VR1-S01
  Top 0.25: JP2.2 4.1,12.4 6.41,14.71 6.41,32.79 U$1.P$5 12.37,38.75 RA1A.1
VR1-S02
  Top 0.203: 11.14,36.16 11.06,36.09
  Top 0.25: RA1B.1 18.04,36.88 17.16,37.75 13.62,37.75 12.03,36.16 U$1.P$4 11.14,36.16 | 11.11,36.13 11.06,36.09 10.56,36.09 7.03,32.55 7.03,14.53 4.73,12.22 4.73,5.31 6.64,3.4 JP2.3
WR  (via drill 0.34)
  Top 0.25: R27.2 32.76,36.9 v32.76,36.25
  Bottom 0.25: v32.76,36.25 33.01,36 33.01,24 20.17,11.16 P1.3

### Text on the board
tNames: RA3 | A | B | C | D | ROCK / DOWN | DC- | DC+ | BIN | BOUT | 256K / SRAM | 8.388 | B | SW | BAT | DC | 5V | GND | PRE-POT / AUDIO | GND | R | L | HP | GND | ROUT | LOUT
bNames: 5V | DC- | DC+ | VCC | GND | CLK | SD | SIN | BATT IN | SOUT | 5V | BATT / OUT | CLK2 | CLK1 | 3.3V | VR1-S01 | SW | VR1-S02 | BAT | GND | LIN | PIN1 | DC | RIN | HP-L | GND | 5V | PIN5 | HP-R | GND | TRIM / WIRE / STUBS | PRE-POT / AUDIO | 32 | 1 | GND | RIGHT | LEFT | HP | GND | ROUT | LOUT | - | +
tStop: -NOT FOR OEM SCREENS- | v2.2 | DMGC-CPU-01
bStop: www.mousebitelabs.com